# EAGLE design tinyduino-breakout-mk-4.1 (EAGLE 7.5.0)
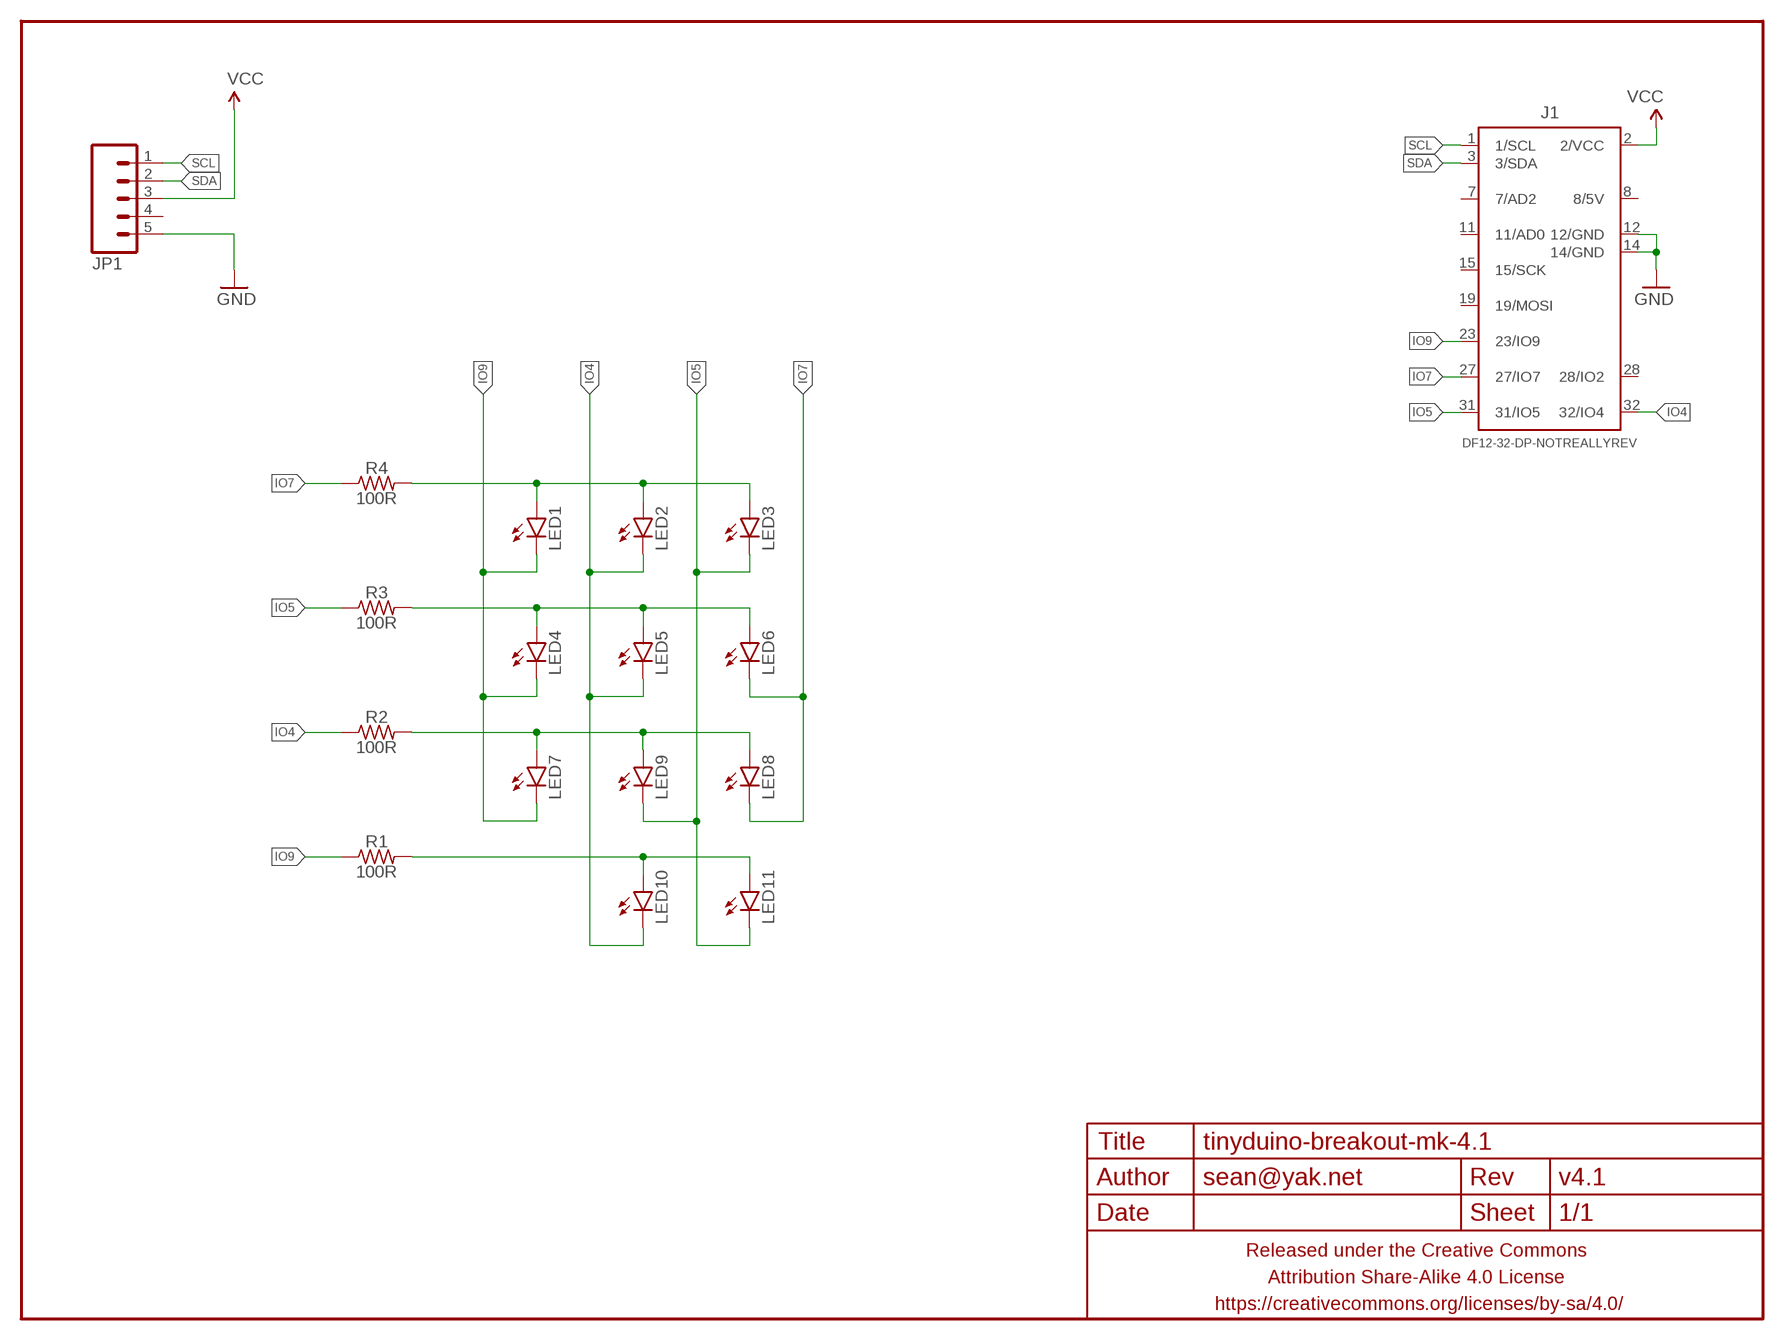
[diagram p0: schematic, sheet 1]

## Parts
FRAME1  FRAME-LETTERNO_PACKAGE  [DUMMY]
J1  DF12-32-DP-NOTREALLYREV  [DF12-32-DP-I2C+EXTRA-REV]
JP1  M05SMD-SHORT  [1X05-SMD-SHORT]
LED1  LED0603  [LED-0603]
LED2  LED0603  [LED-0603]
LED3  LED0603  [LED-0603]
LED4  LED0603  [LED-0603]
LED5  LED0603  [LED-0603]
LED6  LED0603  [LED-0603]
LED7  LED0603  [LED-0603]
LED8  LED0603  [LED-0603]
LED9  LED0603  [LED-0603]
LED10  LED0603  [LED-0603]
LED11  LED0603  [LED-0603]
R1  100R  RESISTORR0603  [R0603]
R2  100R  RESISTORR0603  [R0603]
R3  100R  RESISTORR0603  [R0603]
R4  100R  RESISTORR0603  [R0603]

## Nets
GND: J1.12(12/GND) J1.14(14/GND) JP1.5
IO4: J1.32(32/IO4) LED2.C LED5.C LED10.C R2.1
IO5: J1.31(31/IO5) LED3.C LED9.C LED11.C R3.1
IO7: J1.27(27/IO7) LED6.C LED8.C R4.1
IO9: J1.23(23/IO9) LED1.C LED4.C LED7.C R1.1
N$1: LED1.A LED2.A LED3.A R4.2
N$2: LED4.A LED5.A LED6.A R3.2
N$3: LED7.A LED8.A LED9.A R2.2
N$4: LED10.A LED11.A R1.2
SCL: J1.1(1/SCL) JP1.1
SDA: J1.3(3/SDA) JP1.2
VCC: J1.2(2/VCC) JP1.3
Unconnected: J1.7(7/AD2) J1.8(8/5V) J1.11(11/AD0) J1.15(15/SCK) J1.19(19/MOSI) J1.28(28/IO2) JP1.4

## Library data of the parts
FRAME1 = A_butts:FRAME-LETTER: Schematic Frame Standard 8.5x11 US Letter frame; DESIGNER: sean@yak.net; VERSION: v4.1
J1 = a_parts:DF12-32-DP-NOTREALLY
JP1 = a_parts:M05: Header 5 Standard 5-pin 0.1" header. Use with straight break away headers (SKU : PRT-00116), right angle break away headers (PRT-00553), swiss pins (PRT-00743), machine pins (PRT-00117), and female headers (PRT-00115). Molex polarized connector foot print use with SKU : PRT-08230 with associated crimp pins and housings.
LED1-LED11 = a_parts:LED: LEDs Standard schematic elements and footprints for 5mm, 3mm, 1206, and 0603 sized LEDs. 5mm - Spark Fun Electronics SKU : COM-00529 (and others)
R1-R4 = a_parts:RESISTOR: RESISTOR, American symbol

## Board
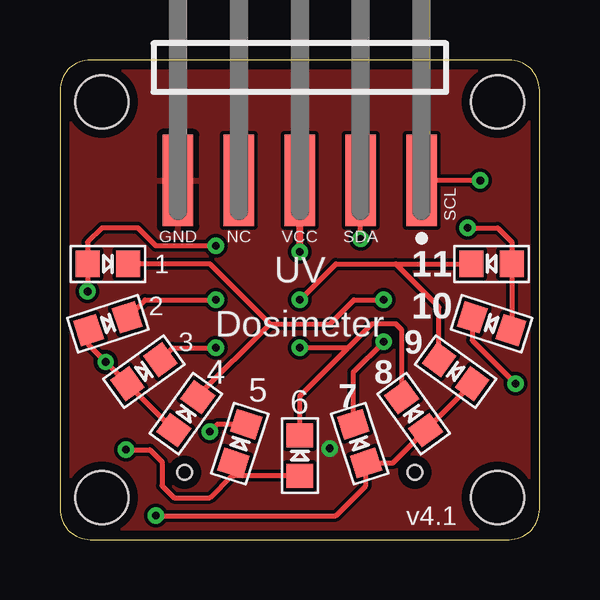
[diagram p1: board, top side]
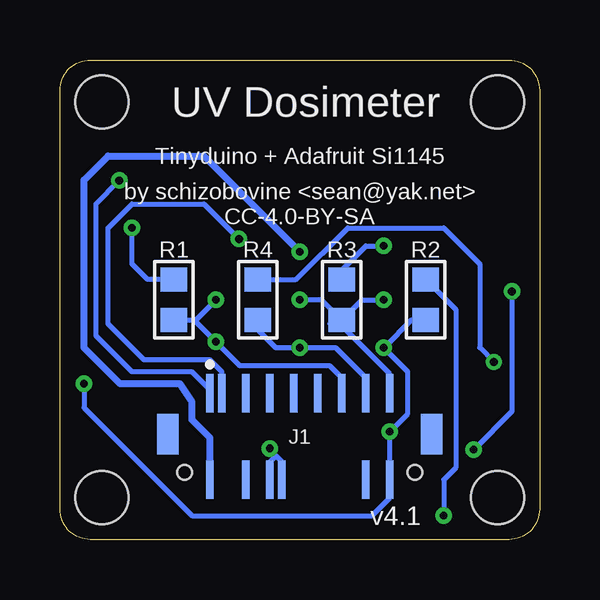
[diagram p2: board, bottom side, seen from below]

Size 20 x 20 mm. Coordinates in mm from the lower left corner, seen from the top.
Outline: 0,18.73 0,1.27 arc90 1.27,0 18.73,0 arc90 20,1.27 20,18.73 arc90 18.73,20 1.27,20 arc90 0,18.73
Copper layers (1*16): Top 0.0356mm / dielectric 1.5011mm / Bottom 0.0356mm
Design rules "LaenPCBOrder_2": minimum track width 6mil, minimum drill 13mil, track to track 6mil, track to pad 6mil, pad to pad 6mil, via to via 6mil, smd to smd 6mil, copper to edge 15mil, drill to drill 6mil, minimum pad ring 7mil, minimum via ring 7mil, stop-mask expansion 3mil, vias tented up to drill 20mil, thermal gap 10mil
Holes 2.2 mm at 1.75,1.75 18.25,1.75 1.75,18.25 18.25,18.25

### Footprints (pad centres in the part's own frame; a part is rotated, then mirrored left to right if it is on the bottom)
DF12-32-DP-I2C+EXTRA-REV = smd 0.3 x 1.6 bottom: 1 -3.75,-1.8; 2 -3.75,1.8; 3 -3.25,-1.8; 7 -2.25,-1.8; 8 -2.25,1.8; 11 -1.25,-1.8; 12 -1.25,1.8; 14 -0.75,1.8; 15 -0.25,-1.8; 19 0.75,-1.8; 23 1.75,-1.8; 27 2.75,-1.8; 28 2.75,1.8; 31 3.75,-1.8; 32 3.75,1.8 | smd 0.9 x 1.7 bottom: F1 -5.5,-0.1; F2 5.5,-0.1 | hole 0.6: -4.8,1.5; 4.8,1.5
1X05-SMD-SHORT = smd 1.27 x 3.81: 1 -5.08,3.175; 2 -2.54,3.175; 3 0,3.175; 4 2.54,3.175; 5 5.08,3.175
LED-0603 = smd 1.1 x 1: A 0,-0.85; C 0,0.85
R0603 = smd 1 x 1.1: 1 -0.85,0; 2 0.85,0

### Placement (x,y rotation side)
FRAME1  0,0 0 top
J1  10,4.3 180 top
JP1  10,18.15 180 top
LED1  5.25,5.25 324 top
LED2  3.5,7 306 top
LED3  2,9 288 top
LED4  2,11.5 270 top
LED5  7.5,4 342 top
LED6  10,3.5 0 top
LED7  12.5,4 18 top
LED8  14.75,5.25 36 top
LED9  16.5,7 54 top
LED10  18,9 72 top
LED11  18,11.5 90 top
R1  15.25,10 90 bottom
R2  4.75,10 90 bottom
R3  8.25,10 90 bottom
R4  11.75,10 90 bottom

### Tracks (layer width: path | path; a pad name or v marks a point on that pad's centre or on a via)
GND  (via drill 0.33)
  Bottom 0.2: J1.14 10.75,3.25 11,3.5 | 11,3.5 11.25,3.25 J1.12 | 11,3.5 v11.25,3.8
  pour Top: 0,0 0,20 20,20 20,0
IO4  (via drill 0.33)
  Top 0.2: LED5.C 6.56,4.81 v6.25,4.5 | LED10.C 17.19,8.31 v19,6.5 | LED2.C 4.69,8 v6.5,8
  Bottom 0.2: v19,6.5 19,5.5 14.5,1 7,1 6.25,1.75 J1.32 v6.25,4.5 5.5,5.25 5.5,7 v6.5,8 5.35,9.15 R2.1
IO5  (via drill 0.33)
  Top 0.2: 14,11.5 11.5,11.5 v10,10 | 14,11.5 LED11.C | LED9.C 15.81,9.69 14,11.5 | LED3.C 3.55,10 v6.5,10
  Bottom 0.2: 8.75,9 R3.1 | J1.31 6.25,6.9 8.25,8.9 R3.1 | R3.1 9.1,10 v10,10 | R3.1 7.4,10 v6.5,10
IO7  (via drill 0.33)
  Top 0.2: LED8.C 14.25,8.75 14,9 13,9 12,8 | LED6.C 10,6 12,8 | 12,8 v10,8
  Bottom 0.2: J1.27 7.25,6.75 8.5,8 v10,8 11,8 11.75,8.75 R4.1
IO9  (via drill 0.33)
  Top 0.2: LED1.C 5.75,6 8.75,9 | LED4.C 6.25,11.5 8.75,9 | LED7.C 12.24,6.99 v13.5,8.25 | 8.75,9 11.25,9 12.25,10 v13.5,10
  Bottom 0.2: J1.23 8.25,6.75 8.75,7.25 12.5,7.25 v13.5,8.25 14.38,9.12 | R1.1 14.4,9.15 14.38,9.12 | v13.5,10 14.38,9.12
N$1  (via drill 0.33)
  Top 0.2: LED1.A LED2.A v1.91,7.41 | v1.91,7.41 1.19,8.12 LED3.A | v1.91,7.41
  Bottom 0.2: v1.91,7.41 2.5,8 2.5,11.5 4,13 8,13 10.15,10.85 R4.2
N$2  (via drill 0.33)
  Top 0.2: v1.15,10.35 LED4.A 1.15,12.4 1.75,13 3.25,13 4,12.25 v6.5,12.25 | v2.75,3.75 3.75,3.75 4.25,3.25 4.25,2.25 4.75,1.75 6.25,1.75 7.15,2.65 7.25,2.65 | LED5.A 7.24,2.66 7.25,2.65 | LED6.A 7.25,2.65
  Bottom 0.2: v1.15,10.35 1.15,5.35 v2.75,3.75 | R3.2 8.25,11.25 7.25,12.25 v6.5,12.25
N$3  (via drill 0.33)
  Top 0.2: v4,1 11.5,1 12.75,2.25 LED7.A 13.88,3.19 LED8.A LED9.A
  Bottom 0.2: R2.2 3.5,9.6 3.5,3 4,2.5 v4,1
N$4  (via drill 0.33)
  Top 0.2: LED10.A 18.85,8.78 LED11.A 18.85,12.4 18.25,13 v17,13
  Bottom 0.2: R1.2 16.35,10.85 17,11.5 v17,13
SCL  (via drill 0.33)
  Top 0.2: v17.52,14.97 JP1.1
  Bottom 0.2: J1.1 13.75,6.25 14.5,7 17,7 18.5,8.5 18.5,14 v17.52,14.97
SDA  (via drill 0.33)
  Top 0.2: v12.54,12.54 JP1.2
  Bottom 0.2: J1.3 13.25,7 13.75,7.5 16.5,7.5 18,9 18,13 17,14 14,14 v12.54,12.54
VCC  (via drill 0.33)
  Top 0.3: v10,12 JP1.3
  Bottom 0.3: J1.2 13.75,4.25 14.5,5 14.5,5.75 15,6.5 17.5,6.5 19,8 19,15 18,16 14,16 v10,12

### Text on the board
tPlace: SCL | GND | NC | VCC | SDA | 1 | 11 | UV | 2 | 10 | Dosimeter | 3 | 9 | 4 | 8 | 5 | 6 | 7
bPlace: UV Dosimeter | Tinyduino + Adafruit Si1145 | by schizobovine <sean@yak.net> / CC-4.0-BY-SA